# EasyEDA schematic stm32f103vet.json
TITLE: Sheet_1; REV: 1.0; Date: 2020-06-04; Sheet: 1/1; Drawn By: node_cell; Company: Your Company
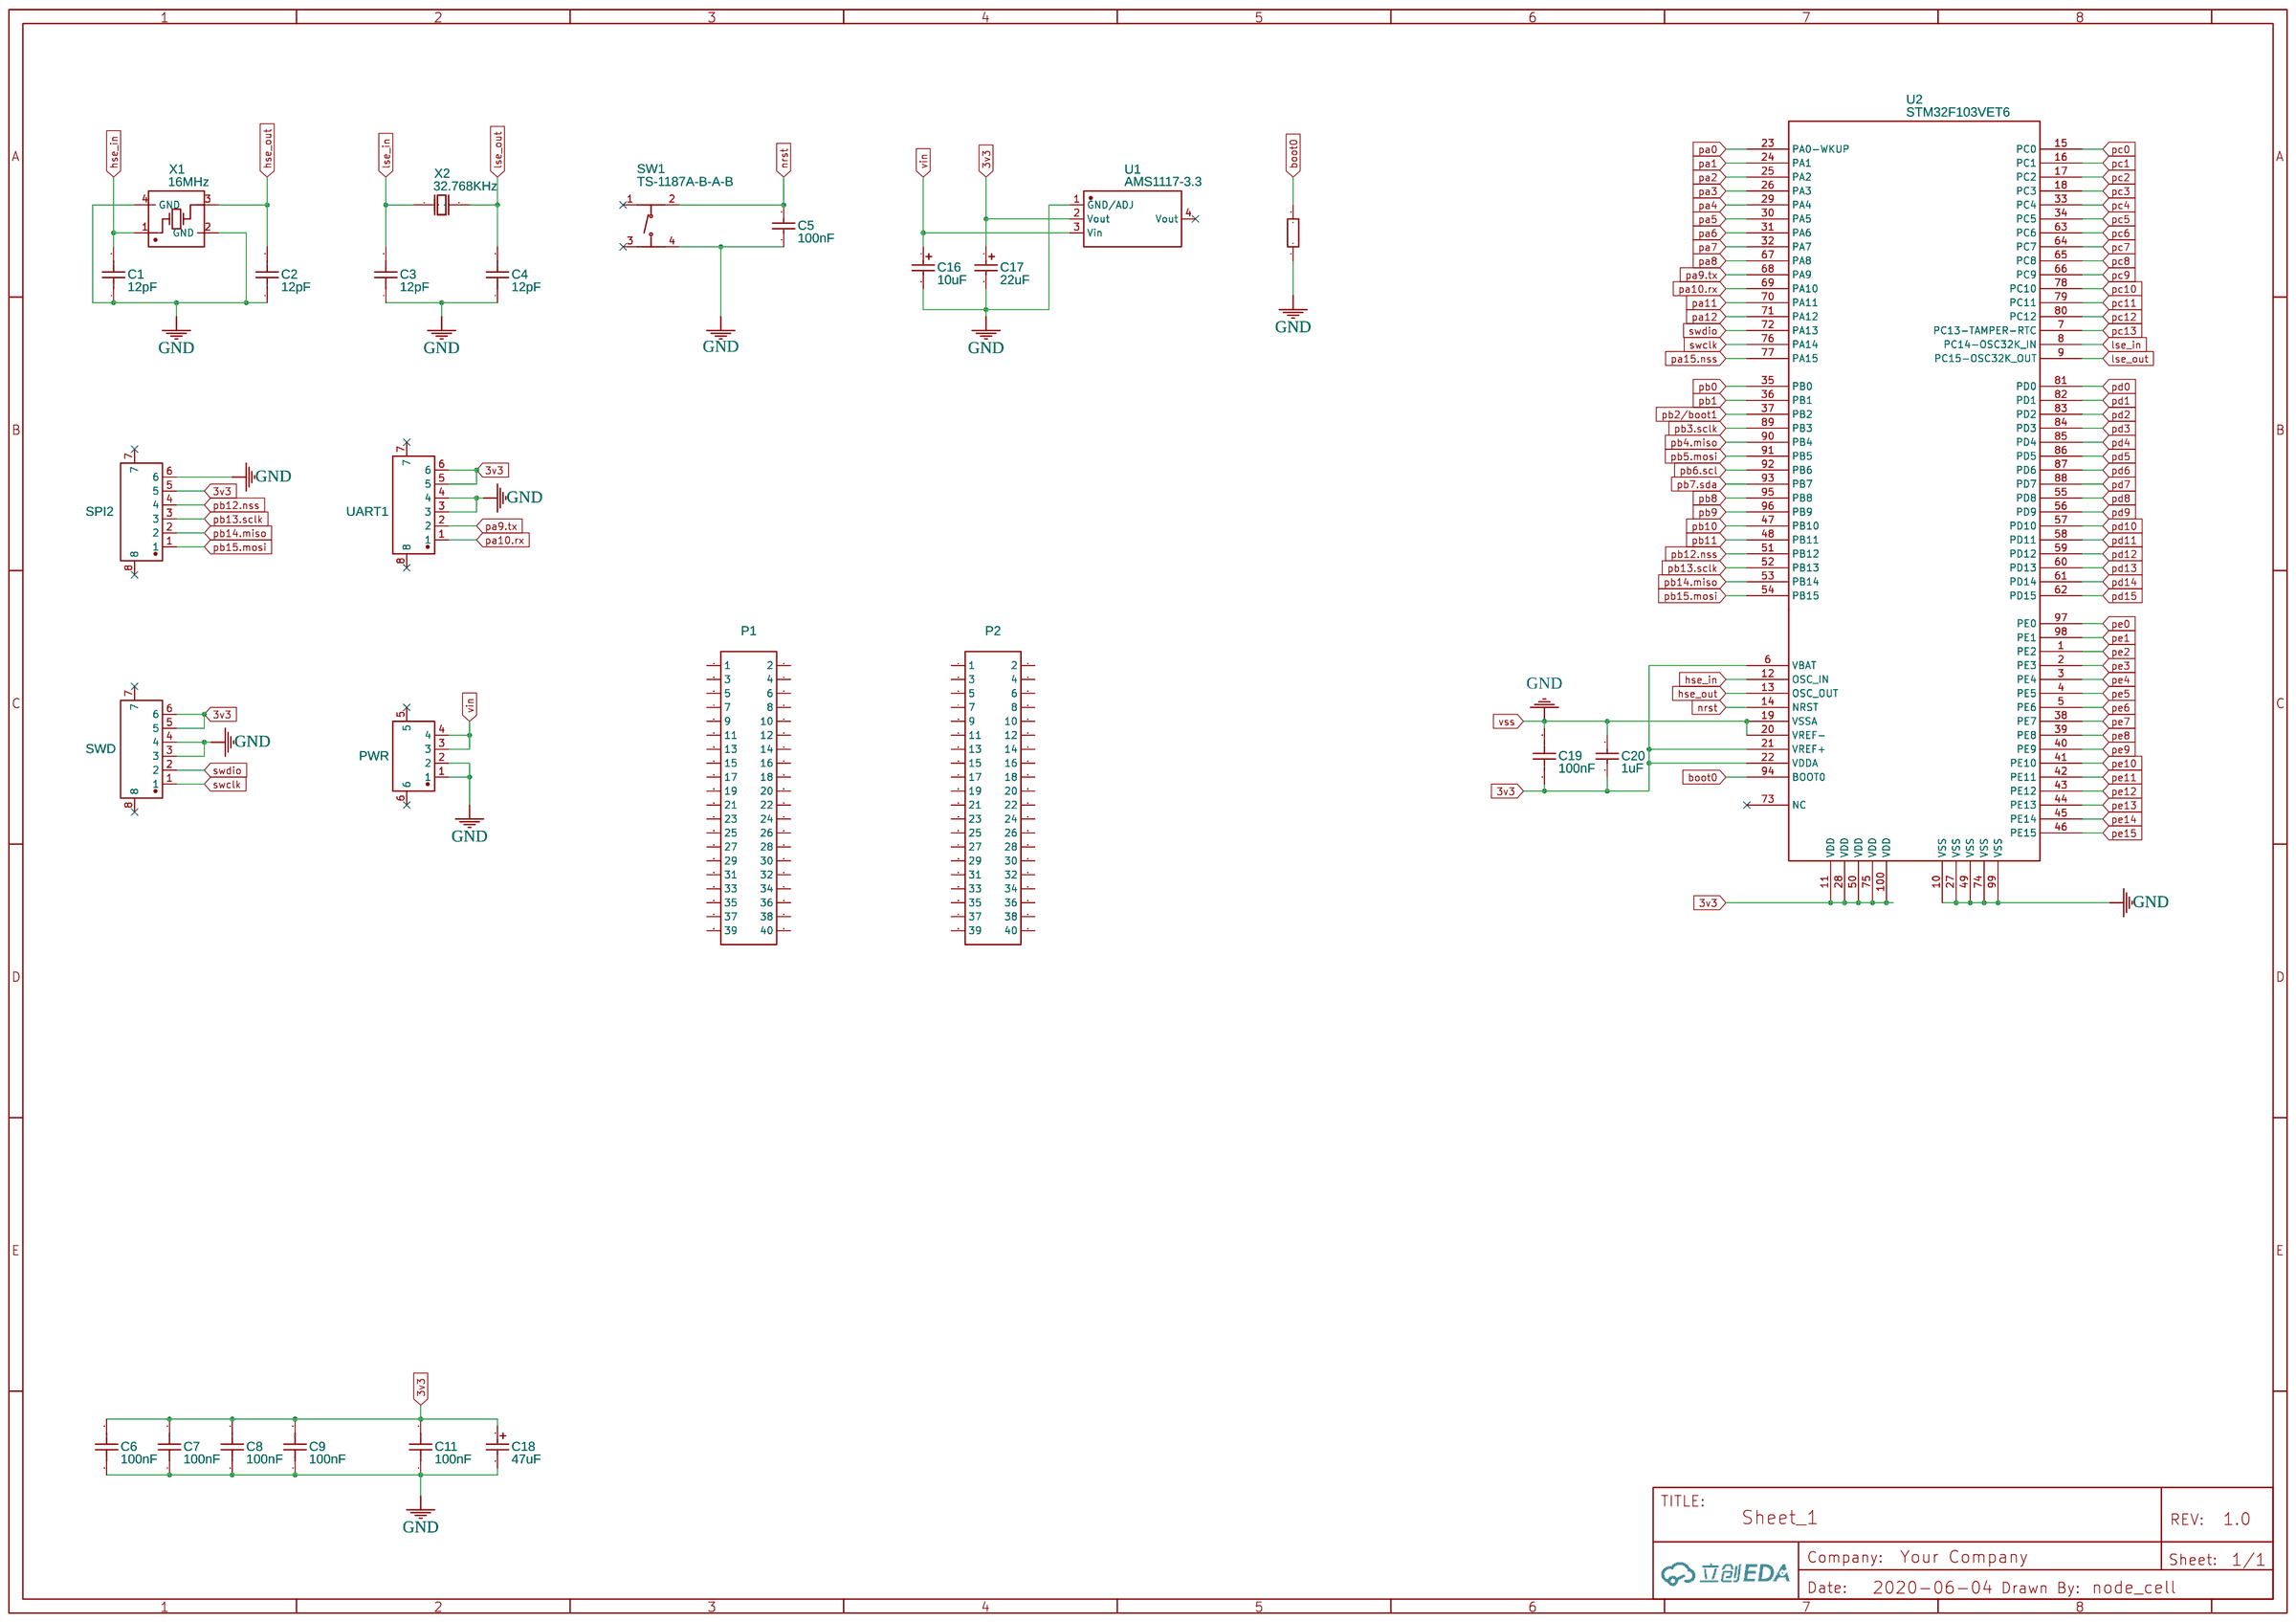
[diagram p0: schematic sheet]

## Parts
C1  12pF  [C0603]
C2  12pF  [C0603]
C3  12pF  [C0603]
C4  12pF  [C0603]
C5  100nF  [C0603]
C6  100nF  [C0603]
C7  100nF  [C0603]
C8  100nF  [C0603]
C9  100nF  [C0603]
C11  100nF  [C0603]
C16  10uF  [CAP-SMD_L3.5-W2.8-R-RD]
C17  22uF  [CAP-SMD_L3.5-W2.8-R-RD]
C18  47uF  [CAP-SMD_L6.0-W3.2-R-RD]
C19  100nF  [C0603]
C20  1uF  [C0603]
P1  Header-Female-2.54_2x20  [HDR-TH_40P-P2.54-V-R2-C20-S2.54]
P2  Header-Female-2.54_2x20  [HDR-TH_40P-P2.54-V-R2-C20-S2.54]
PWR  AFC10-S04QCC-00  [CONN-SMD_4P-H-P1.00-TL_AFC10-S04QCC-00]
R2  10K  [R0603]
SPI2  AFC10-S06QCC-00  [CONN-SMD_6P-P1.00-H-M_AFC10-S06QCC-00]
SW1  TS-1187A-B-A-B  [SW-SMD_4P-L5.1-W5.1-P3.70-LS6.4]
SWD  AFC10-S06QCC-00  [CONN-SMD_6P-P1.00-H-M_AFC10-S06QCC-00]
U1  AMS1117-3.3  [SOT-223-3_L6.5-W3.4-P2.30-LS7.0-BR]
U2  STM32F103VET6  [LQFP-100_L14.0-W14.0-P0.50-LS16.0-BL]
UART1  AFC10-S06QCC-00  [CONN-SMD_6P-P1.00-H-M_AFC10-S06QCC-00]
X1  16MHz  [OSC-SMD_4P-L3.2-W2.5-BL]
X2  32.768KHz  [OSC-SMD_2P-L2.0-W1.2]

## Library data of the parts
C1-C4 = 06035A120K4T2A: Supplier: LCSC; Supplier Part: C382067; Manufacturer: AVX; Contributor: LCSC
C5 = 0603F104M500NT: Supplier: LCSC; Manufacturer: FH; Supplier Part: C42998
C6-C9 C11 C19 = C0603X104K050T: Supplier: LCSC; Supplier Part: C187860; Manufacturer: Holy Stone Enterprise; Contributor: LCSC
C16 = TAJB106K016RNJ: Supplier: LCSC; Manufacturer: AVX; Supplier Part: C7193; LCSC Assembly: Yes; SMT Type: Extend
C17 = TAJB226K016RNJ: Supplier: LCSC; Manufacturer: AVX; Supplier Part: C8020; LCSC Assembly: Yes; SMT Type: Extend
C18 = TAJC476K016RNJ: Supplier: LCSC; Manufacturer: AVX; Supplier Part: C7219; LCSC Assembly: Yes; SMT Type: Extend
C20 = CL10A105KA8NNNC: Supplier: LCSC; Manufacturer: SAMSUNG; Supplier Part: C5673; LCSC Assembly: Yes; SMT Type: Extend
P1 P2 = Header-Female-2.54_2x20: Supplier: LCSC; Manufacturer: BOOMELE; Manufacturer Part: 2.54mm 2*20PFemale header; image: //image.lceda.cn/szlcsc/C50982.jpg; Supplier Part: C50982
PWR = AFC10-S04QCC-00: Supplier: LCSC; Supplier Part: C395301; Manufacturer: JUSHUO; Contributor: LCSC
R2 = 0603WAF1002T5E: Supplier: LCSC; Manufacturer: UniOhm; LCSC Assembly: Yes; Supplier Part: C25804; SMT Type: Basic
SPI2 SWD UART1 = AFC10-S06QCC-00: Supplier: LCSC; Supplier Part: C395303; Manufacturer: JUSHUO; Contributor: LCSC
SW1 = TS-1187A-B-A-B: Supplier: LCSC; Supplier Part: C318884; Manufacturer: XKB Enterprise; Contributor: LCSC; LCSC Assembly: Yes; SMT Type: Extend
U1 = AMS1117-3.3: sourceId: dwIGgezVh; Supplier: LCSC; Manufacturer: AMS; LCSC Assembly: Yes; image: //image.lceda.cn/szlcsc/C6186.jpg; Supplier Part: C6186; SMT Type: Basic
U2 = STM32F103VET6: Supplier: LCSC; Manufacturer: STMicroelectronics; LCSC Assembly: Yes; image: //image.lceda.cn/szlcsc/C8308.jpg; Supplier Part: C8308; SMT Type: Basic
X1 = AM16000001: Supplier: LCSC; Supplier Part: C409359; Manufacturer: TXC Corp; Contributor: LCSC
X2 = 9H03200028: Supplier: LCSC; Supplier Part: C409339; Manufacturer: TXC Corp; Contributor: LCSC

## Nets
3v3: C6.2 C7.2 C8.2 C9.2 C11.2 C17.1 C18.1 C19.1 C20.1 SPI2.5 SWD.5 SWD.6 U1.2(Vout) U2.6(VBAT) U2.11(VDD) U2.21(VREF+) U2.22(VDDA) U2.28(VDD) U2.50(VDD) U2.75(VDD) U2.100(VDD) UART1.5 UART1.6
GND: C1.1 C2.1 C3.1 C4.1 C5.1 C6.1 C7.1 C8.1 C9.1 C11.1 C16.2 C17.2 C18.2 C19.2 C20.2 PWR.1 PWR.2 R2.1 SPI2.6 SW1.4(D) SWD.3 SWD.4 U1.1(GND/ADJ) U2.10(VSS) U2.19(VSSA) U2.20(VREF-) U2.27(VSS) U2.49(VSS) U2.74(VSS) U2.99(VSS) UART1.3 UART1.4 X1.2(GND) X1.4(GND)
vin: C16.1 PWR.3 PWR.4 U1.3(Vin)
boot0: R2.2 U2.94(BOOT0)
hse_in: C1.2 U2.12(OSC_IN) X1.1
hse_out: C2.2 U2.13(OSC_OUT) X1.3
lse_in: C3.2 U2.8(PC14-OSC32K_IN) X2.1(OSC1)
lse_out: C4.2 U2.9(PC15-OSC32K_OUT) X2.2(OSC2)
nrst: C5.2 SW1.2(B) U2.14(NRST)
pa0: U2.23(PA0-WKUP)
pa1: U2.24(PA1)
pa2: U2.25(PA2)
pa3: U2.26(PA3)
pa4: U2.29(PA4)
pa5: U2.30(PA5)
pa6: U2.31(PA6)
pa7: U2.32(PA7)
pa8: U2.67(PA8)
pa9.tx: U2.68(PA9) UART1.2
pa10.rx: U2.69(PA10) UART1.1
pa11: U2.70(PA11)
pa12: U2.71(PA12)
pa15.nss: U2.77(PA15)
pb0: U2.35(PB0)
pb1: U2.36(PB1)
pb2/boot1: U2.37(PB2)
pb3.sclk: U2.89(PB3)
pb4.miso: U2.90(PB4)
pb5.mosi: U2.91(PB5)
pb6.scl: U2.92(PB6)
pb7.sda: U2.93(PB7)
pb8: U2.95(PB8)
pb9: U2.96(PB9)
pb10: U2.47(PB10)
pb11: U2.48(PB11)
pb12.nss: SPI2.4 U2.51(PB12)
pb13.sclk: SPI2.3 U2.52(PB13)
pb14.miso: SPI2.2 U2.53(PB14)
pb15.mosi: SPI2.1 U2.54(PB15)
pc0: U2.15(PC0)
pc1: U2.16(PC1)
pc2: U2.17(PC2)
pc3: U2.18(PC3)
pc4: U2.33(PC4)
pc5: U2.34(PC5)
pc6: U2.63(PC6)
pc7: U2.64(PC7)
pc8: U2.65(PC8)
pc9: U2.66(PC9)
pc10: U2.78(PC10)
pc11: U2.79(PC11)
pc12: U2.80(PC12)
pc13: U2.7(PC13-TAMPER-RTC)
pd0: U2.81(PD0)
pd1: U2.82(PD1)
pd2: U2.83(PD2)
pd3: U2.84(PD3)
pd4: U2.85(PD4)
pd5: U2.86(PD5)
pd6: U2.87(PD6)
pd7: U2.88(PD7)
pd8: U2.55(PD8)
pd9: U2.56(PD9)
pd10: U2.57(PD10)
pd11: U2.58(PD11)
pd12: U2.59(PD12)
pd13: U2.60(PD13)
pd14: U2.61(PD14)
pd15: U2.62(PD15)
pe0: U2.97(PE0)
pe1: U2.98(PE1)
pe2: U2.1(PE2)
pe3: U2.2(PE3)
pe4: U2.3(PE4)
pe5: U2.4(PE5)
pe6: U2.5(PE6)
pe7: U2.38(PE7)
pe8: U2.39(PE8)
pe9: U2.40(PE9)
pe10: U2.41(PE10)
pe11: U2.42(PE11)
pe12: U2.43(PE12)
pe13: U2.44(PE13)
pe14: U2.45(PE14)
pe15: U2.46(PE15)
swclk: SWD.1 U2.76(PA14)
swdio: SWD.2 U2.72(PA13)

Not connected (* = marked no-connect by the designer): P1 1 2 3 4 5 6 7 8 9 10 11 12 13 14 15 16 17 18 19 20 21 22 23 24 25 26 27 28 29 30 31 32 33 34 35 36 37 38 39 40; P2 1 2 3 4 5 6 7 8 9 10 11 12 13 14 15 16 17 18 19 20 21 22 23 24 25 26 27 28 29 30 31 32 33 34 35 36 37 38 39 40; PWR 5* 6*; SPI2 7* 8*; SW1 1(A)* 3(C)*; SWD 7* 8*; U1 4(Vout)*; U2 73(NC)*; UART1 7* 8*
